# EasyEDA schematic SCH_东方红半导体演奏器_2022-09-28.json

## Sheets
1 乘法器: TITLE: M3495-BIS; REV: 1.0; Date: 2021-10-16; Sheet: 1/1; Drawn By: BH2VGM; Company: NEU-ISE
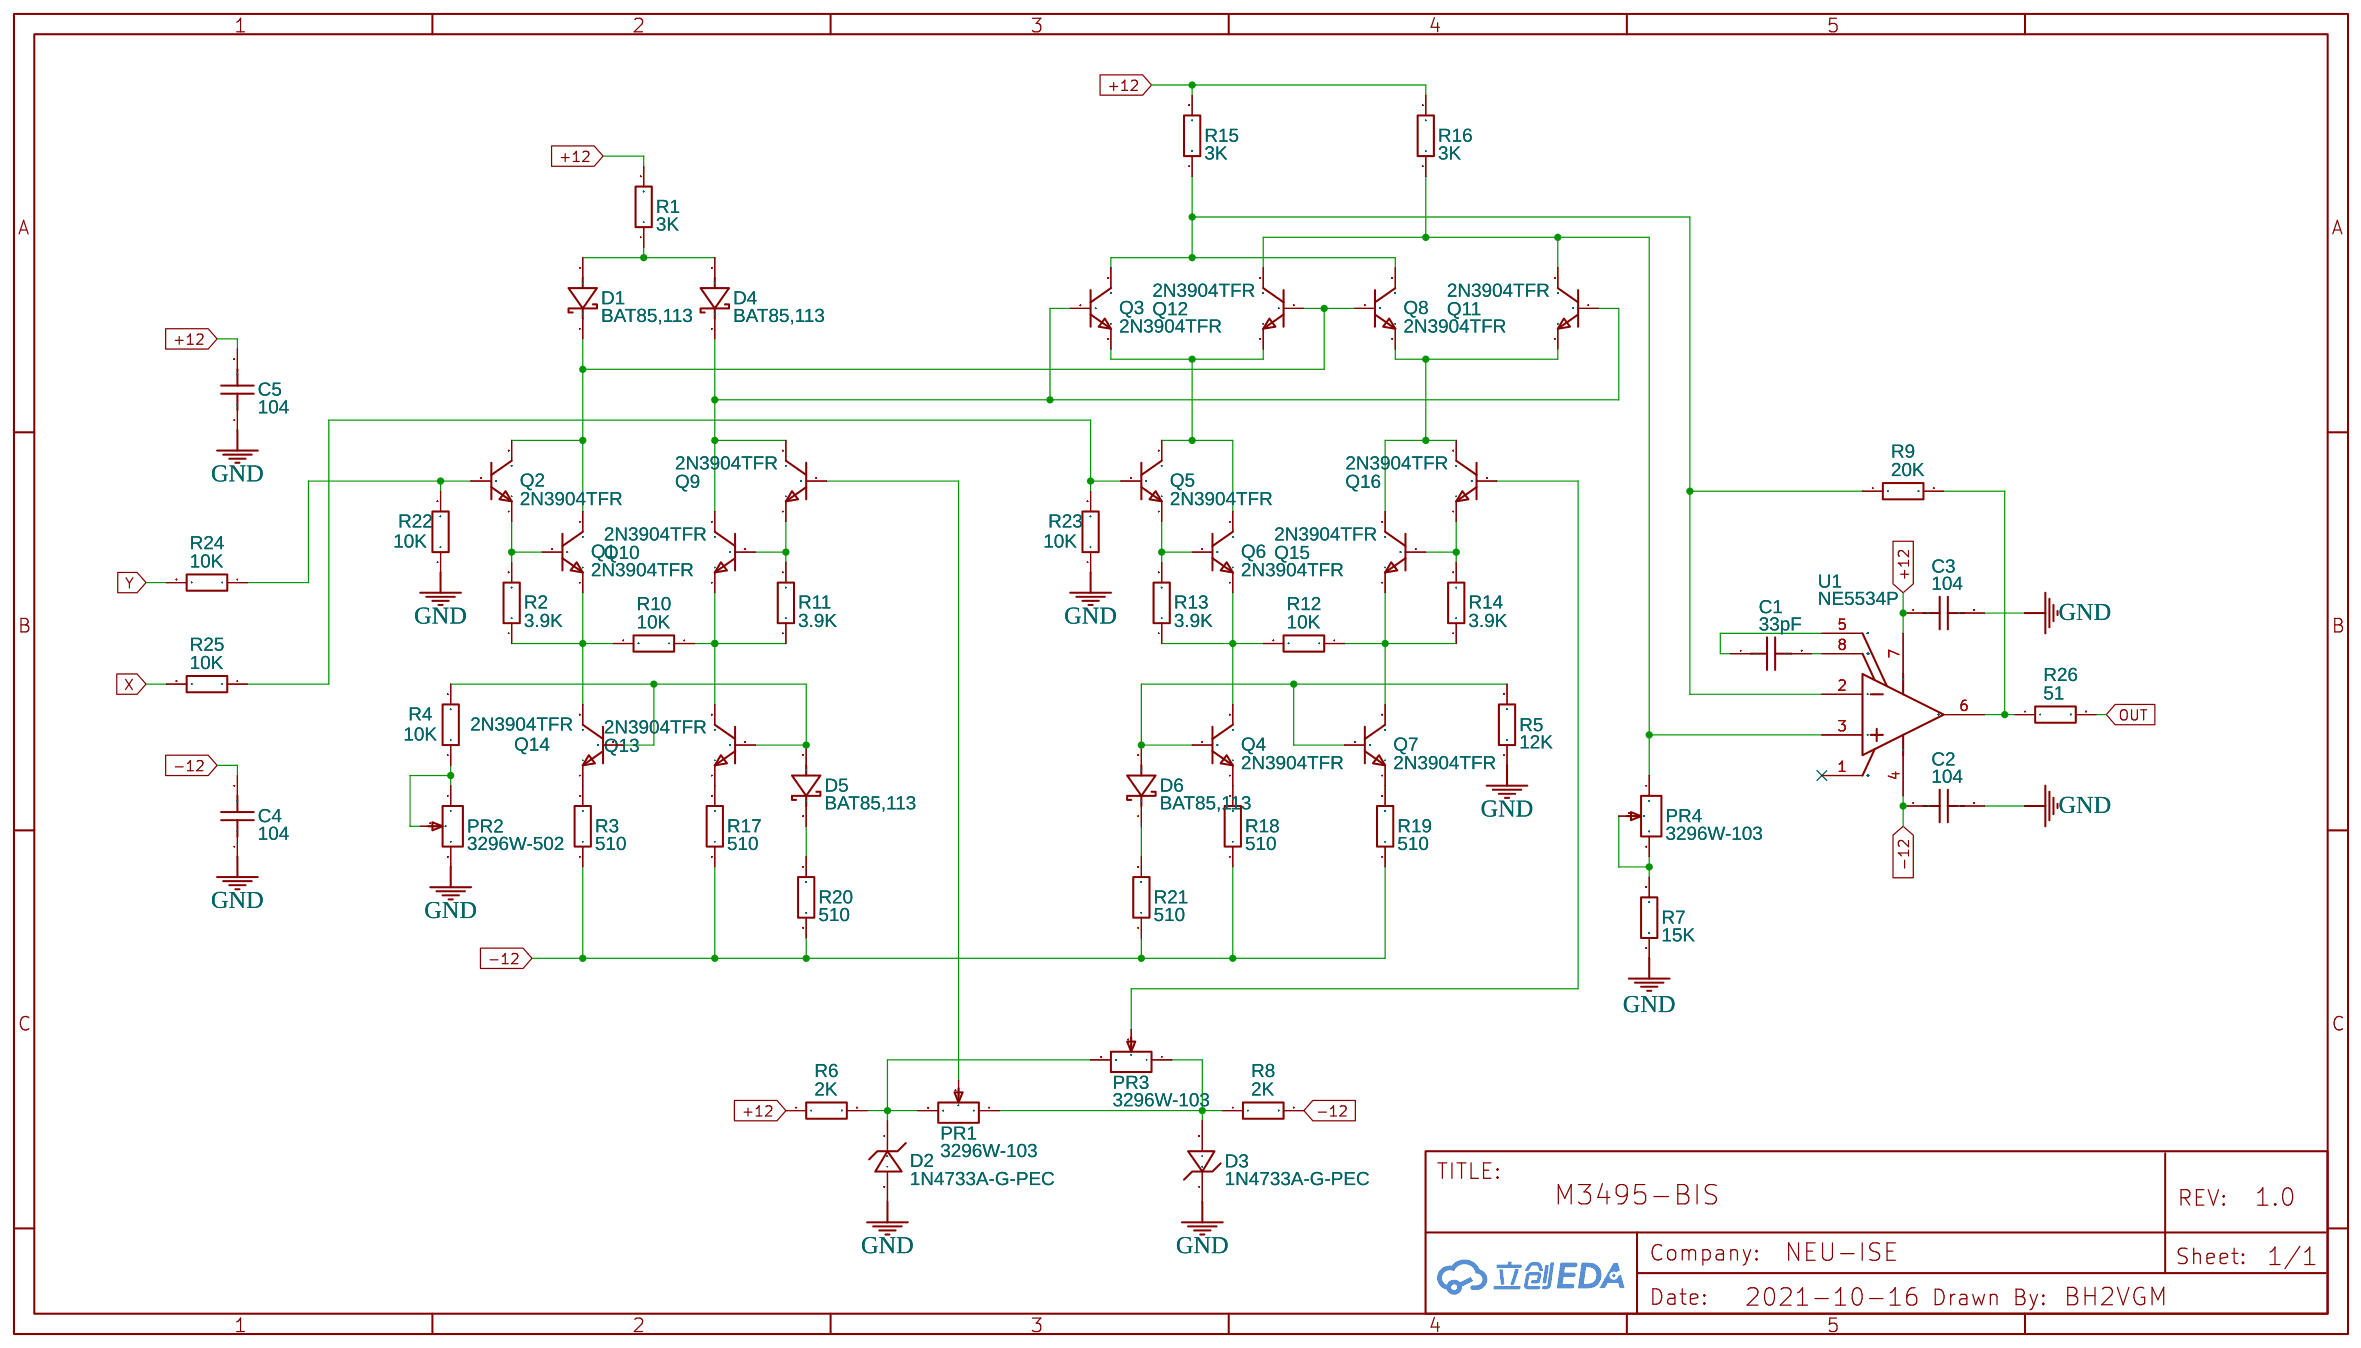
[diagram p0: 乘法器]
2 衰减信号发生器: TITLE: 衰减信号发生器; Company: NEU - ISE
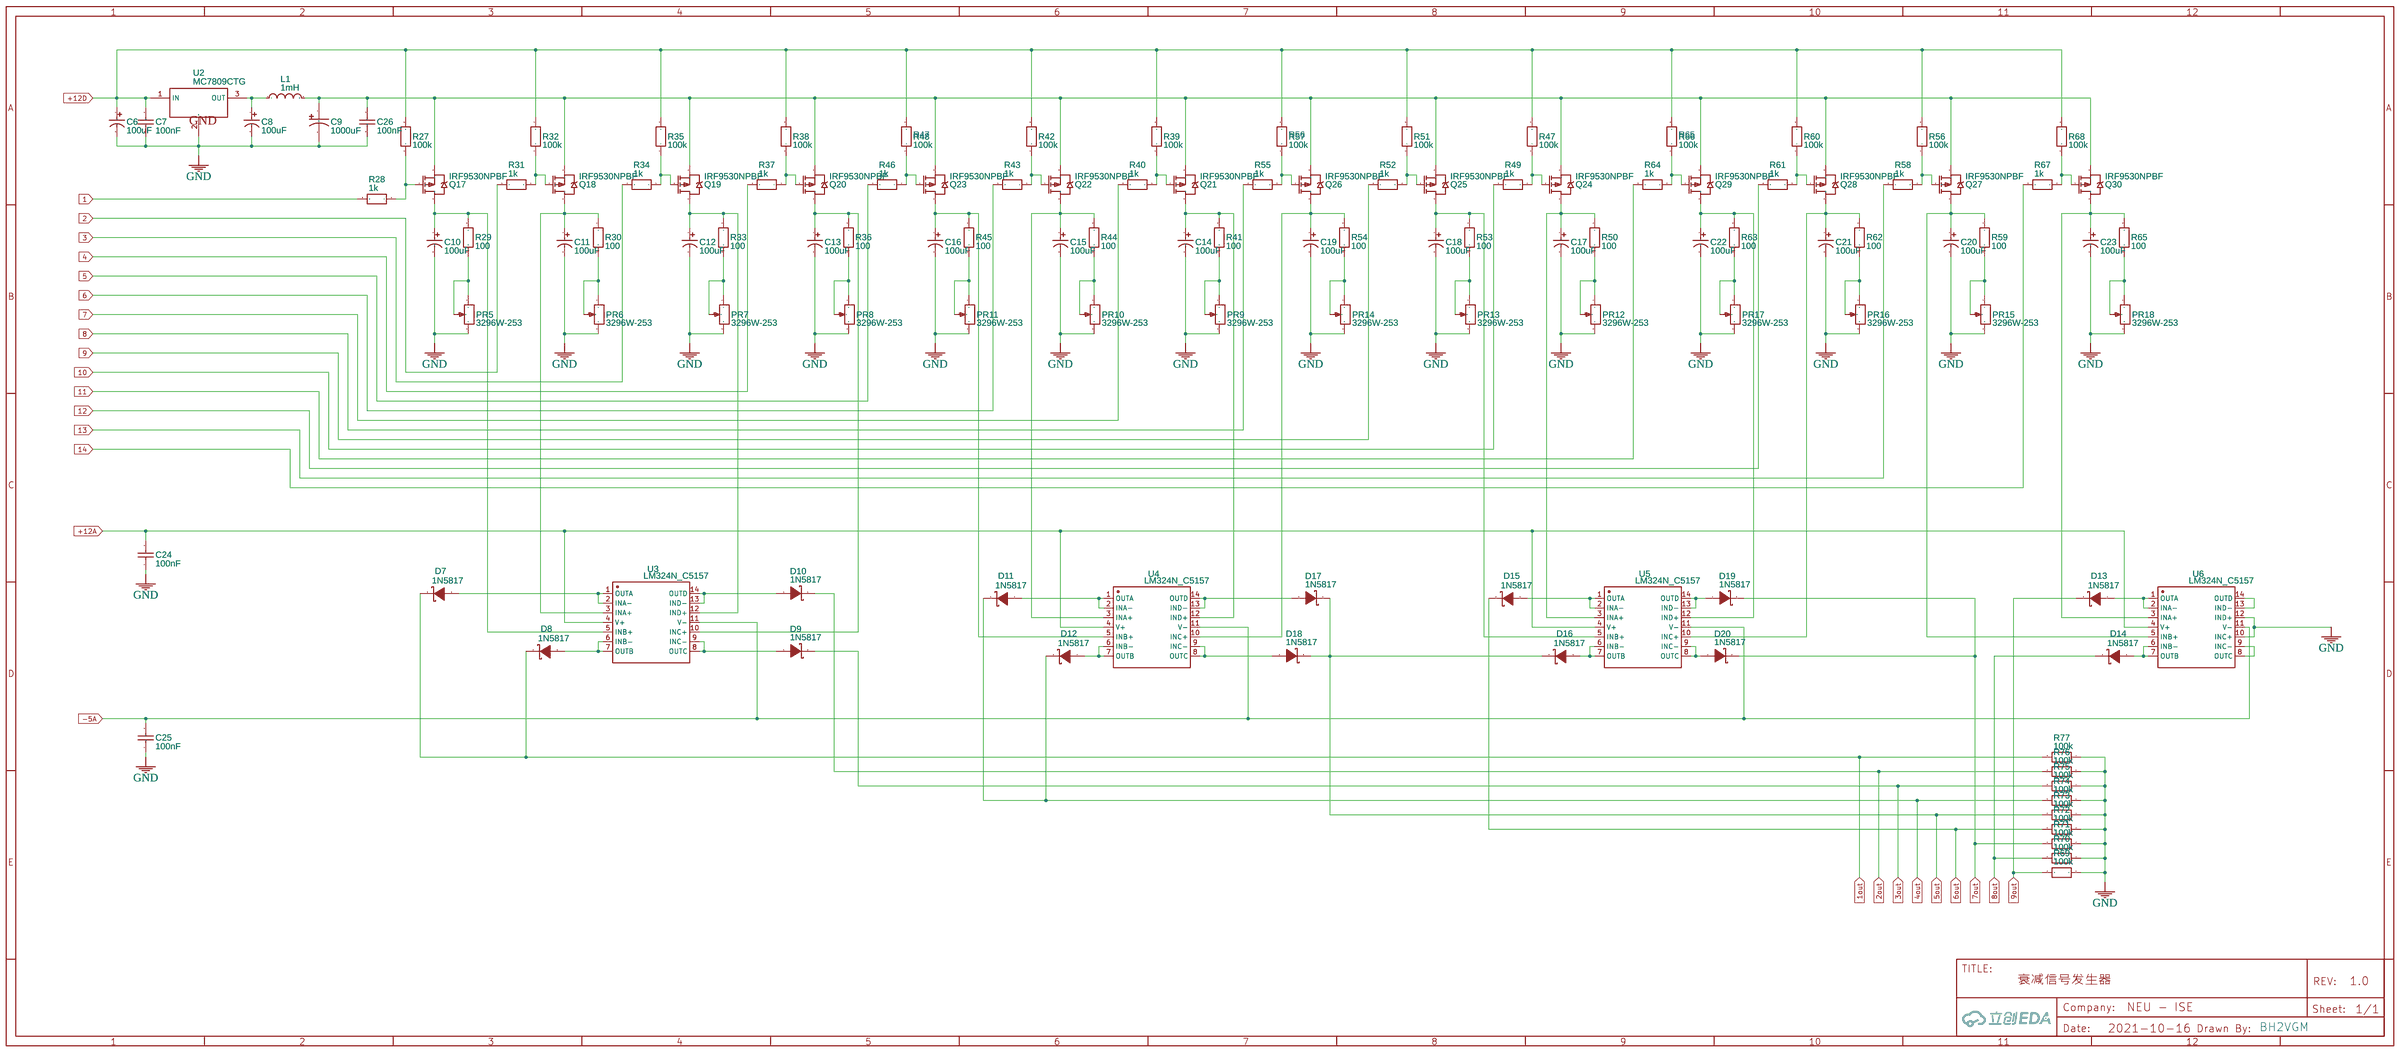
[diagram p1: 衰减信号发生器]
3 合成器: TITLE: 合成器; Date: 2021-10-24; Company: NEU - ISE
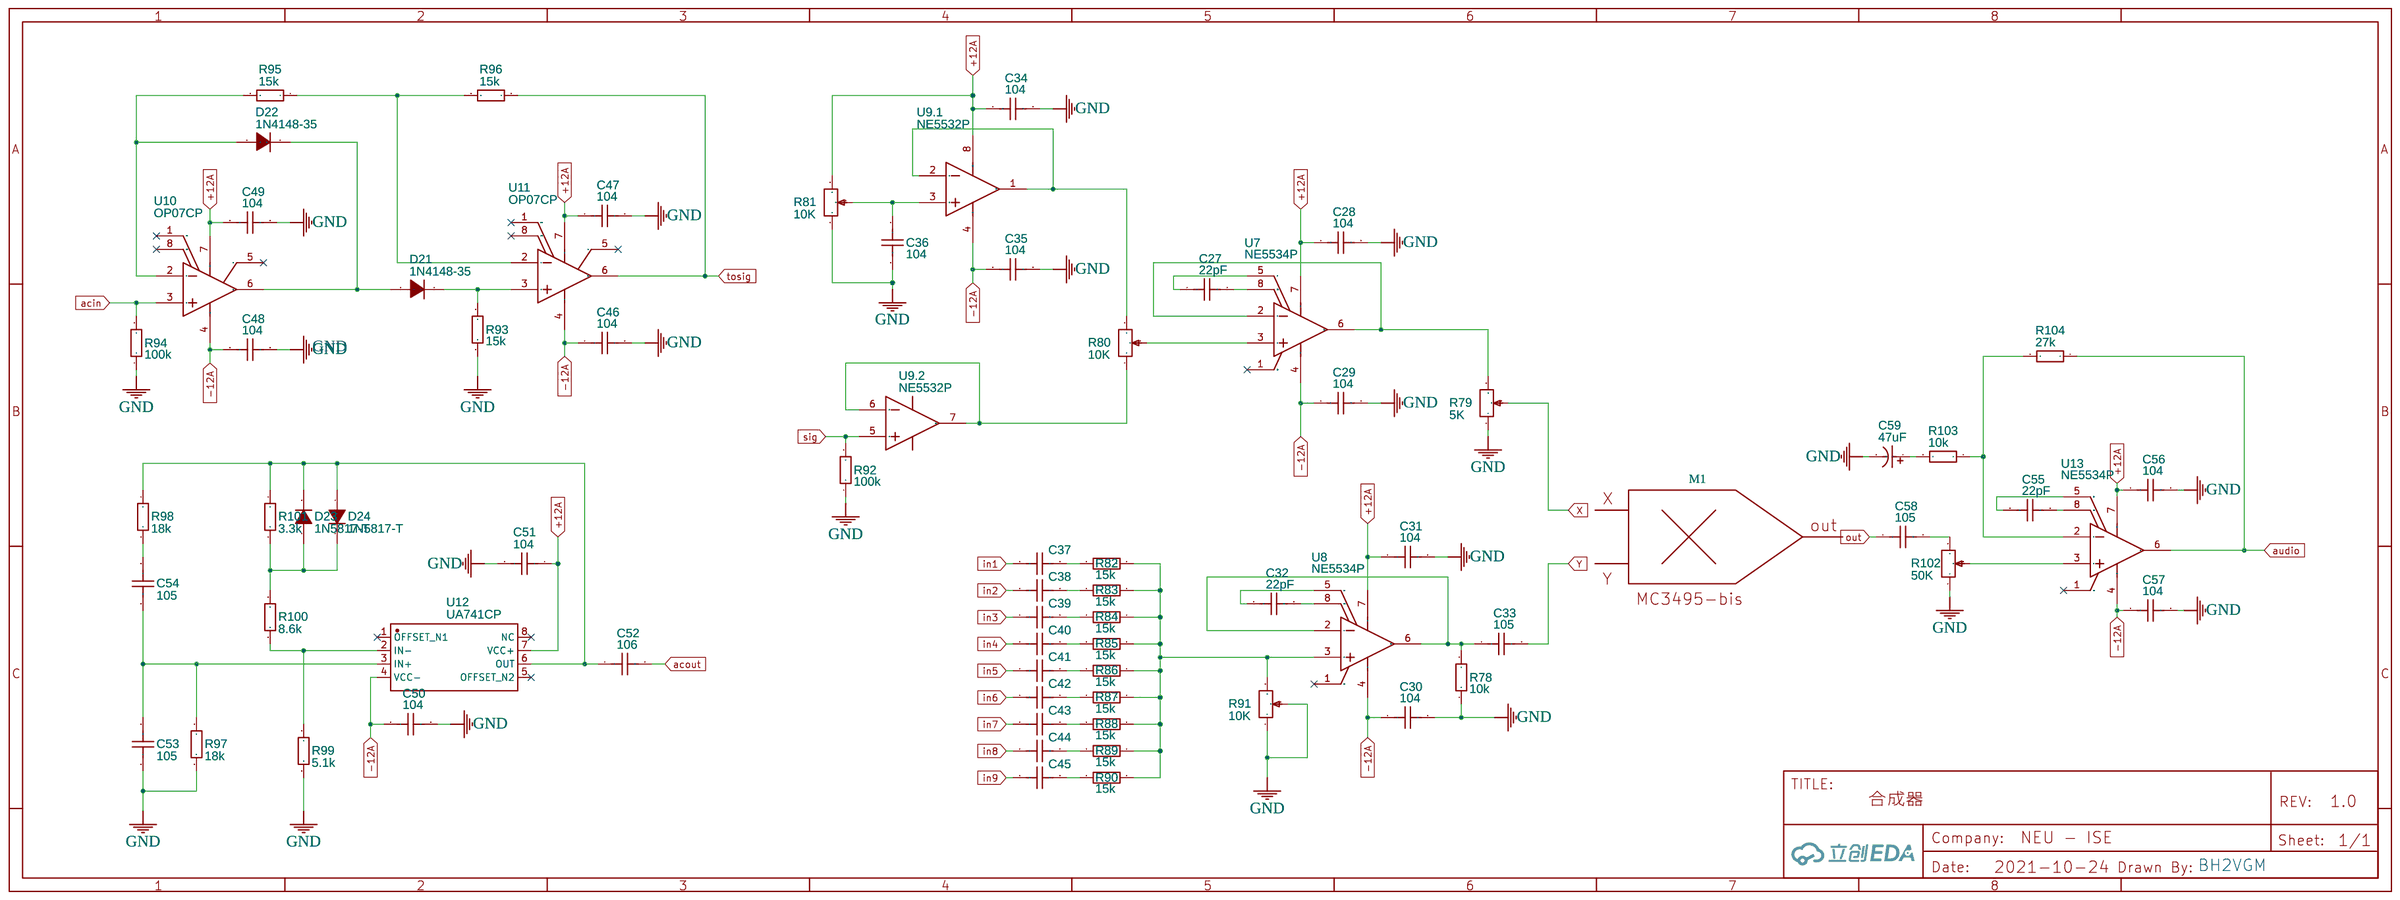
[diagram p2: 合成器]
4 音阶发生器: TITLE: Signals Generator; Company: NEU - ISE
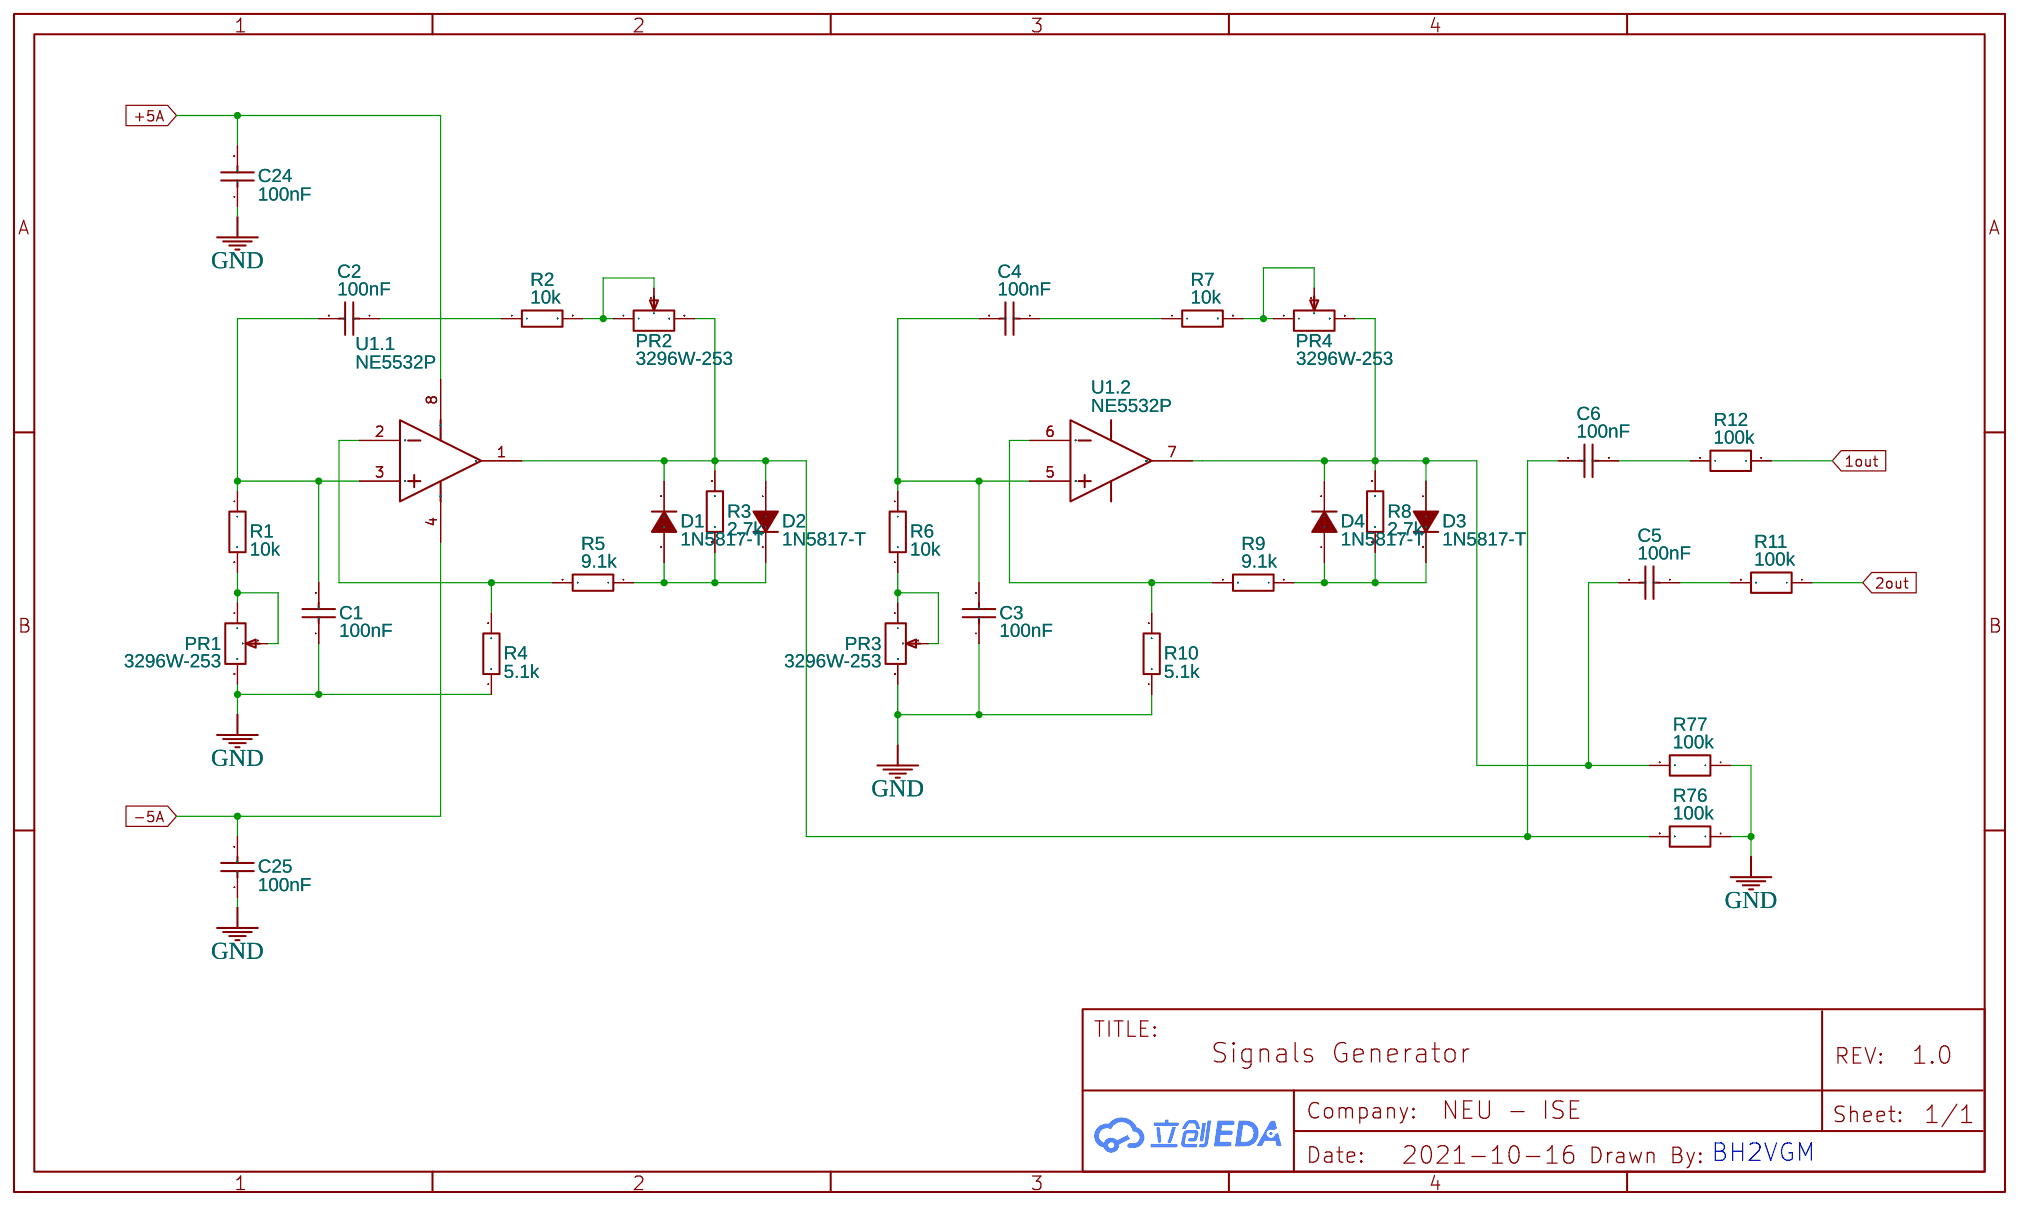
[diagram p3: 音阶发生器]

## Parts
sheet 乘法器
C1  33pF  [CAP-TH_L4.8-W3.2-P5.08-D1.2]
C2  104  [CAP-TH_L4.8-W3.2-P5.08-D1.2]
C3  104  [CAP-TH_L4.8-W3.2-P5.08-D1.2]
C4  104  [CAP-TH_L4.8-W3.2-P5.08-D1.2]
C5  104  [CAP-TH_L4.8-W3.2-P5.08-D1.2]
D1  BAT85,113  [DO-34_BD1.6-L3.0-P7.00-D0.6-RD]
D2  1N4733A-G-PEC  [DO-41G_BD2.4-L4.0-P8.00-D0.7-RD]
D3  1N4733A-G-PEC  [DO-41G_BD2.4-L4.0-P8.00-D0.7-RD]
D4  BAT85,113  [DO-34_BD1.6-L3.0-P7.00-D0.6-RD]
D5  BAT85,113  [DO-34_BD1.6-L3.0-P7.00-D0.6-RD]
D6  BAT85,113  [DO-34_BD1.6-L3.0-P7.00-D0.6-RD]
PR1  3296W-103  [RES-ADJ-TH_3296W]
PR2  3296W-502  [RES-ADJ-TH_3296W]
PR3  3296W-103  [RES-ADJ-TH_3296W]
PR4  3296W-103  [RES-ADJ-TH_3296W]
Q1  2N3904TFR  [TO-92-3_L4.8-W3.7-P2.54-L]
Q2  2N3904TFR  [TO-92-3_L4.8-W3.7-P2.54-L]
Q3  2N3904TFR  [TO-92-3_L4.8-W3.7-P2.54-L]
Q4  2N3904TFR  [TO-92-3_L4.8-W3.7-P2.54-L]
Q5  2N3904TFR  [TO-92-3_L4.8-W3.7-P2.54-L]
Q6  2N3904TFR  [TO-92-3_L4.8-W3.7-P2.54-L]
Q7  2N3904TFR  [TO-92-3_L4.8-W3.7-P2.54-L]
Q8  2N3904TFR  [TO-92-3_L4.8-W3.7-P2.54-L]
Q9  2N3904TFR  [TO-92-3_L4.8-W3.7-P2.54-L]
Q10  2N3904TFR  [TO-92-3_L4.8-W3.7-P2.54-L]
Q11  2N3904TFR  [TO-92-3_L4.8-W3.7-P2.54-L]
Q12  2N3904TFR  [TO-92-3_L4.8-W3.7-P2.54-L]
Q13  2N3904TFR  [TO-92-3_L4.8-W3.7-P2.54-L]
Q14  2N3904TFR  [TO-92-3_L4.8-W3.7-P2.54-L]
Q15  2N3904TFR  [TO-92-3_L4.8-W3.7-P2.54-L]
Q16  2N3904TFR  [TO-92-3_L4.8-W3.7-P2.54-L]
R1  3K  [RES-TH_BD2.3-L6.5-P10.50-D0.5]
R2  3.9K  [RES-TH_BD2.3-L6.5-P10.50-D0.5]
R3  510  [RES-TH_BD2.4-L6.3-P10.30-D0.6]
R4  10K  [RES-TH_BD2.3-L6.5-P10.50-D0.5]
R5  12K  [RES-TH_BD2.2-L6.5-P10.50-D0.6]
R6  2K  [RES-TH_BD2.3-L6.5-P10.50-D0.5]
R7  15K  [RES-TH_BD2.3-L6.5-P10.50-D0.5]
R8  2K  [RES-TH_BD2.3-L6.5-P10.50-D0.5]
R9  20K  [RES-TH_BD2.3-L6.5-P10.50-D0.5]
R10  10K  [RES-TH_BD2.3-L6.5-P10.50-D0.5]
R11  3.9K  [RES-TH_BD2.3-L6.5-P10.50-D0.5]
R12  10K  [RES-TH_BD2.3-L6.5-P10.50-D0.5]
R13  3.9K  [RES-TH_BD2.3-L6.5-P10.50-D0.5]
R14  3.9K  [RES-TH_BD2.3-L6.5-P10.50-D0.5]
R15  3K  [RES-TH_BD2.3-L6.5-P10.50-D0.5]
R16  3K  [RES-TH_BD2.3-L6.5-P10.50-D0.5]
R17  510  [RES-TH_BD2.4-L6.3-P10.30-D0.6]
R18  510  [RES-TH_BD2.4-L6.3-P10.30-D0.6]
R19  510  [RES-TH_BD2.4-L6.3-P10.30-D0.6]
R20  510  [RES-TH_BD2.4-L6.3-P10.30-D0.6]
R21  510  [RES-TH_BD2.4-L6.3-P10.30-D0.6]
R22  10K  [RES-TH_BD2.3-L6.5-P10.50-D0.5]
R23  10K  [RES-TH_BD2.3-L6.5-P10.50-D0.5]
R24  10K  [RES-TH_BD2.3-L6.5-P10.50-D0.5]
R25  10K  [RES-TH_BD2.3-L6.5-P10.50-D0.5]
R26  51  [RES-TH_BD2.3-L6.5-P10.50-D0.5]
U1  NE5534P  [DIP-8_L10.1-W6.3-P2.54-LS7.6-BL]
sheet 合成器
C27  22pF  [CAP-TH_L4.8-W3.2-P5.08-D0.5]
C28  104  [CAP-TH_L4.8-W3.2-P5.08-D0.5]
C29  104  [CAP-TH_L4.8-W3.2-P5.08-D0.5]
C30  104  [CAP-TH_L4.8-W3.2-P5.08-D0.5]
C31  104  [CAP-TH_L4.8-W3.2-P5.08-D0.5]
C32  22pF  [CAP-TH_L4.8-W3.2-P5.08-D0.5]
C33  105  [CAP-TH_L4.8-W3.2-P5.08-D0.5]
C34  104  [CAP-TH_L4.8-W3.2-P5.08-D0.5]
C35  104  [CAP-TH_L4.8-W3.2-P5.08-D0.5]
C36  104  [CAP-TH_L4.8-W3.2-P5.08-D0.5]
C37  104  [CAP-TH_L4.8-W3.2-P5.08-D0.5]
C38  104  [CAP-TH_L4.8-W3.2-P5.08-D0.5]
C39  104  [CAP-TH_L4.8-W3.2-P5.08-D0.5]
C40  104  [CAP-TH_L4.8-W3.2-P5.08-D0.5]
C41  104  [CAP-TH_L4.8-W3.2-P5.08-D0.5]
C42  104  [CAP-TH_L4.8-W3.2-P5.08-D0.5]
C43  104  [CAP-TH_L4.8-W3.2-P5.08-D0.5]
C44  104  [CAP-TH_L4.8-W3.2-P5.08-D0.5]
C45  104  [CAP-TH_L4.8-W3.2-P5.08-D0.5]
C46  104  [CAP-TH_L4.8-W3.2-P5.08-D0.5]
C47  104  [CAP-TH_L4.8-W3.2-P5.08-D0.5]
C48  104  [CAP-TH_L4.8-W3.2-P5.08-D0.5]
C49  104  [CAP-TH_L4.8-W3.2-P5.08-D0.5]
C50  104  [CAP-TH_L4.8-W3.2-P5.08-D0.5]
C51  104  [CAP-TH_L4.8-W3.2-P5.08-D0.5]
C52  106  [CAP-TH_L4.8-W3.2-P5.08-D0.5]
C53  105  [CAP-TH_L4.8-W3.2-P5.08-D0.5]
C54  105  [CAP-TH_L4.8-W3.2-P5.08-D0.5]
C55  22pF  [CAP-TH_L4.8-W3.2-P5.08-D0.5]
C56  104  [CAP-TH_L4.8-W3.2-P5.08-D0.5]
C57  104  [CAP-TH_L4.8-W3.2-P5.08-D0.5]
C58  105  [CAP-TH_L4.8-W3.2-P5.08-D0.5]
C59  47uF  [CAP-TH_BD5.0-P2.00-D0.8-FD]
D21  1N4148-35  [DO-35_BD2.0-L4.2-P8.20-D0.5-RD]
D22  1N4148-35  [DO-35_BD2.0-L4.2-P8.20-D0.5-RD]
D23  1N5817-T  [DO-41_BD2.4-L4.7-P8.70-D0.9-FD]
D24  1N5817-T  [DO-41_BD2.4-L4.7-P8.70-D0.9-FD]
M1  none
R78  10k  [RES-TH_BD2.3-L6.5-P10.50-D0.5]
R79  5K  [RES-ADJ-TH_3296W]
R80  10K  [RES-ADJ-TH_3296W]
R81  10K  [RES-ADJ-TH_3296W]
R82  15k  [RES-TH_BD2.3-L6.5-P10.50-D0.5]
R83  15k  [RES-TH_BD2.3-L6.5-P10.50-D0.5]
R84  15k  [RES-TH_BD2.3-L6.5-P10.50-D0.5]
R85  15k  [RES-TH_BD2.3-L6.5-P10.50-D0.5]
R86  15k  [RES-TH_BD2.3-L6.5-P10.50-D0.5]
R87  15k  [RES-TH_BD2.3-L6.5-P10.50-D0.5]
R88  15k  [RES-TH_BD2.3-L6.5-P10.50-D0.5]
R89  15k  [RES-TH_BD2.3-L6.5-P10.50-D0.5]
R90  15k  [RES-TH_BD2.3-L6.5-P10.50-D0.5]
R91  10K  [RES-ADJ-TH_3296W]
R92  100k  [RES-TH_BD2.3-L6.5-P10.50-D0.5]
R93  15k  [RES-TH_BD2.3-L6.5-P10.50-D0.5]
R94  100k  [RES-TH_BD2.3-L6.5-P10.50-D0.5]
R95  15k  [RES-TH_BD2.3-L6.5-P10.50-D0.5]
R96  15k  [RES-TH_BD2.3-L6.5-P10.50-D0.5]
R97  18k  [RES-TH_BD2.3-L6.5-P10.50-D0.5]
R98  18k  [RES-TH_BD2.3-L6.5-P10.50-D0.5]
R99  5.1k  [RES-TH_BD2.3-L6.5-P10.50-D0.5]
R100  8.6k  [RES-TH_BD2.3-L6.5-P10.50-D0.5]
R101  3.3k  [RES-TH_BD2.3-L6.5-P10.50-D0.5]
R102  50K  [RES-ADJ-TH_3296W]
R103  10k  [RES-TH_BD2.3-L6.5-P10.50-D0.5]
R104  27k  [RES-TH_BD2.3-L6.5-P10.50-D0.5]
U7  NE5534P  [DIP-8_L10.1-W6.3-P2.54-LS7.6-BL]
U8  NE5534P  [DIP-8_L10.1-W6.3-P2.54-LS7.6-BL]
U9  NE5532P  [DIP-8_L9.4-W6.4-P2.54-LS9.1-BL]  (sections 1,2)
U10  OP07CP  [DIP-8_L9.4-W6.4-P2.54-LS9.1-BL]
U11  OP07CP  [DIP-8_L9.4-W6.4-P2.54-LS9.1-BL]
U12  UA741CP  [DIP-8_L9.6-W6.4-P2.54-LS7.6-BL-1]
U13  NE5534P  [DIP-8_L10.1-W6.3-P2.54-LS7.6-BL]
sheet 衰减信号发生器
C6  100uF  [CAP-TH_BD8.0-P3.50-D0.6-FD]
C7  100nF  [CAP-TH_L5.3-W3.8-P5.08-D0.5]
C8  100uF  [CAP-TH_BD8.0-P3.50-D0.6-FD]
C9  1000uF  [CAP-TH_BD12.5-P5.00-D0.6-FD]
C10  100uF  [CAP-TH_BD8.0-P3.50-D0.6-FD]
C11  100uF  [CAP-TH_BD8.0-P3.50-D0.6-FD]
C12  100uF  [CAP-TH_BD8.0-P3.50-D0.6-FD]
C13  100uF  [CAP-TH_BD8.0-P3.50-D0.6-FD]
C14  100uF  [CAP-TH_BD8.0-P3.50-D0.6-FD]
C15  100uF  [CAP-TH_BD8.0-P3.50-D0.6-FD]
C16  100uF  [CAP-TH_BD8.0-P3.50-D0.6-FD]
C17  100uF  [CAP-TH_BD8.0-P3.50-D0.6-FD]
C18  100uF  [CAP-TH_BD8.0-P3.50-D0.6-FD]
C19  100uF  [CAP-TH_BD8.0-P3.50-D0.6-FD]
C20  100uF  [CAP-TH_BD8.0-P3.50-D0.6-FD]
C21  100uF  [CAP-TH_BD8.0-P3.50-D0.6-FD]
C22  100uF  [CAP-TH_BD8.0-P3.50-D0.6-FD]
C23  100uF  [CAP-TH_BD8.0-P3.50-D0.6-FD]
C24  100nF  [CAP-TH_L5.3-W3.8-P5.08-D0.5]
C25  100nF  [CAP-TH_L5.3-W3.8-P5.08-D0.5]
C26  100nF  [CAP-TH_L5.3-W3.8-P5.08-D0.5]
D7  1N5817  [DO-41_BD2.4-L4.7-P8.70-D0.9-FD]
D8  1N5817  [DO-41_BD2.4-L4.7-P8.70-D0.9-FD]
D9  1N5817  [DO-41_BD2.4-L4.7-P8.70-D0.9-FD]
D10  1N5817  [DO-41_BD2.4-L4.7-P8.70-D0.9-FD]
D11  1N5817  [DO-41_BD2.4-L4.7-P8.70-D0.9-FD]
D12  1N5817  [DO-41_BD2.4-L4.7-P8.70-D0.9-FD]
D13  1N5817  [DO-41_BD2.4-L4.7-P8.70-D0.9-FD]
D14  1N5817  [DO-41_BD2.4-L4.7-P8.70-D0.9-FD]
D15  1N5817  [DO-41_BD2.4-L4.7-P8.70-D0.9-FD]
D16  1N5817  [DO-41_BD2.4-L4.7-P8.70-D0.9-FD]
D17  1N5817  [DO-41_BD2.4-L4.7-P8.70-D0.9-FD]
D18  1N5817  [DO-41_BD2.4-L4.7-P8.70-D0.9-FD]
D19  1N5817  [DO-41_BD2.4-L4.7-P8.70-D0.9-FD]
D20  1N5817  [DO-41_BD2.4-L4.7-P8.70-D0.9-FD]
L1  1mH  [IND-TH_BD9.5-P5.00-D0.7]
PR5  3296W-253  [RES-ADJ-TH_3296W]
PR6  3296W-253  [RES-ADJ-TH_3296W]
PR7  3296W-253  [RES-ADJ-TH_3296W]
PR8  3296W-253  [RES-ADJ-TH_3296W]
PR9  3296W-253  [RES-ADJ-TH_3296W]
PR10  3296W-253  [RES-ADJ-TH_3296W]
PR11  3296W-253  [RES-ADJ-TH_3296W]
PR12  3296W-253  [RES-ADJ-TH_3296W]
PR13  3296W-253  [RES-ADJ-TH_3296W]
PR14  3296W-253  [RES-ADJ-TH_3296W]
PR15  3296W-253  [RES-ADJ-TH_3296W]
PR16  3296W-253  [RES-ADJ-TH_3296W]
PR17  3296W-253  [RES-ADJ-TH_3296W]
PR18  3296W-253  [RES-ADJ-TH_3296W]
Q17  IRF9530NPBF  [TO-220-3_L10.0-W4.5-P2.54-L]
Q18  IRF9530NPBF  [TO-220-3_L10.0-W4.5-P2.54-L]
Q19  IRF9530NPBF  [TO-220-3_L10.0-W4.5-P2.54-L]
Q20  IRF9530NPBF  [TO-220-3_L10.0-W4.5-P2.54-L]
Q21  IRF9530NPBF  [TO-220-3_L10.0-W4.5-P2.54-L]
Q22  IRF9530NPBF  [TO-220-3_L10.0-W4.5-P2.54-L]
Q23  IRF9530NPBF  [TO-220-3_L10.0-W4.5-P2.54-L]
Q24  IRF9530NPBF  [TO-220-3_L10.0-W4.5-P2.54-L]
Q25  IRF9530NPBF  [TO-220-3_L10.0-W4.5-P2.54-L]
Q26  IRF9530NPBF  [TO-220-3_L10.0-W4.5-P2.54-L]
Q27  IRF9530NPBF  [TO-220-3_L10.0-W4.5-P2.54-L]
Q28  IRF9530NPBF  [TO-220-3_L10.0-W4.5-P2.54-L]
Q29  IRF9530NPBF  [TO-220-3_L10.0-W4.5-P2.54-L]
Q30  IRF9530NPBF  [TO-220-3_L10.0-W4.5-P2.54-L]
R27  100k  [RES-TH_BD2.4-L6.3-P10.30-D0.6]
R28  1k  [RES-TH_BD2.4-L6.3-P10.30-D0.6]
R29  100  [RES-TH_BD2.4-L6.3-P10.30-D0.6]
R30  100  [RES-TH_BD2.4-L6.3-P10.30-D0.6]
R31  1k  [RES-TH_BD2.4-L6.3-P10.30-D0.6]
R32  100k  [RES-TH_BD2.4-L6.3-P10.30-D0.6]
R33  100  [RES-TH_BD2.4-L6.3-P10.30-D0.6]
R34  1k  [RES-TH_BD2.4-L6.3-P10.30-D0.6]
R35  100k  [RES-TH_BD2.4-L6.3-P10.30-D0.6]
R36  100  [RES-TH_BD2.4-L6.3-P10.30-D0.6]
R37  1k  [RES-TH_BD2.4-L6.3-P10.30-D0.6]
R38  100k  [RES-TH_BD2.4-L6.3-P10.30-D0.6]
R39  100k  [RES-TH_BD2.4-L6.3-P10.30-D0.6]
R40  1k  [RES-TH_BD2.4-L6.3-P10.30-D0.6]
R41  100  [RES-TH_BD2.4-L6.3-P10.30-D0.6]
R42  100k  [RES-TH_BD2.4-L6.3-P10.30-D0.6]
R43  1k  [RES-TH_BD2.4-L6.3-P10.30-D0.6]
R44  100  [RES-TH_BD2.4-L6.3-P10.30-D0.6]
R45  100  [RES-TH_BD2.4-L6.3-P10.30-D0.6]
R46  1k  [RES-TH_BD2.4-L6.3-P10.30-D0.6]
R47  100k  [RES-TH_BD2.4-L6.3-P10.30-D0.6]
R48  100k  [RES-TH_BD2.4-L6.3-P10.30-D0.6]
R49  1k  [RES-TH_BD2.4-L6.3-P10.30-D0.6]
R50  100  [RES-TH_BD2.4-L6.3-P10.30-D0.6]
R51  100k  [RES-TH_BD2.4-L6.3-P10.30-D0.6]
R52  1k  [RES-TH_BD2.4-L6.3-P10.30-D0.6]
R53  100  [RES-TH_BD2.4-L6.3-P10.30-D0.6]
R54  100  [RES-TH_BD2.4-L6.3-P10.30-D0.6]
R55  1k  [RES-TH_BD2.4-L6.3-P10.30-D0.6]
R56  100k  [RES-TH_BD2.4-L6.3-P10.30-D0.6]
R57  100k  [RES-TH_BD2.4-L6.3-P10.30-D0.6]
R58  1k  [RES-TH_BD2.4-L6.3-P10.30-D0.6]
R59  100  [RES-TH_BD2.4-L6.3-P10.30-D0.6]
R60  100k  [RES-TH_BD2.4-L6.3-P10.30-D0.6]
R61  1k  [RES-TH_BD2.4-L6.3-P10.30-D0.6]
R62  100  [RES-TH_BD2.4-L6.3-P10.30-D0.6]
R63  100  [RES-TH_BD2.4-L6.3-P10.30-D0.6]
R64  1k  [RES-TH_BD2.4-L6.3-P10.30-D0.6]
R65  100  [RES-TH_BD2.4-L6.3-P10.30-D0.6]
R66  100k  [RES-TH_BD2.4-L6.3-P10.30-D0.6]
R67  1k  [RES-TH_BD2.4-L6.3-P10.30-D0.6]
R68  100k  [RES-TH_BD2.4-L6.3-P10.30-D0.6]
R69  100k  [RES-TH_BD2.4-L6.3-P10.30-D0.6]
R70  100k  [RES-TH_BD2.4-L6.3-P10.30-D0.6]
R71  100k  [RES-TH_BD2.4-L6.3-P10.30-D0.6]
R72  100k  [RES-TH_BD2.4-L6.3-P10.30-D0.6]
R73  100k  [RES-TH_BD2.4-L6.3-P10.30-D0.6]
R74  100k  [RES-TH_BD2.4-L6.3-P10.30-D0.6]
R75  100k  [RES-TH_BD2.4-L6.3-P10.30-D0.6]
R76  100k  [RES-TH_BD2.4-L6.3-P10.30-D0.6]
R77  100k  [RES-TH_BD2.4-L6.3-P10.30-D0.6]
U2  MC7809CTG  [TO-220-3_L10.0-W4.5-P2.54-L]
U3  LM324N_C5157  [PDIP-14_L19.7-W6.6-P2.54-LS8.3-BL]
U4  LM324N_C5157  [PDIP-14_L19.7-W6.6-P2.54-LS8.3-BL]
U5  LM324N_C5157  [PDIP-14_L19.7-W6.6-P2.54-LS8.3-BL]
U6  LM324N_C5157  [PDIP-14_L19.7-W6.6-P2.54-LS8.3-BL]
sheet 音阶发生器
C1#2  100nF  [RAD-0.2]
C2#2  100nF  [RAD-0.2]
C3#2  100nF  [RAD-0.2]
C4#2  100nF  [RAD-0.2]
C5#2  100nF  [RAD-0.2]
C6#2  100nF  [RAD-0.2]
C24#2  100nF  [CAP-TH_L5.3-W3.8-P5.08-D0.5]
C25#2  100nF  [CAP-TH_L5.3-W3.8-P5.08-D0.5]
D1#2  1N5817-T  [DO-41_BD2.4-L4.7-P8.70-D0.9-FD]
D2#2  1N5817-T  [DO-41_BD2.4-L4.7-P8.70-D0.9-FD]
D3#2  1N5817-T  [DO-41_BD2.4-L4.7-P8.70-D0.9-FD]
D4#2  1N5817-T  [DO-41_BD2.4-L4.7-P8.70-D0.9-FD]
PR1#2  3296W-253  [RES-ADJ-TH_3296W]
PR2#2  3296W-253  [RES-ADJ-TH_3296W]
PR3#2  3296W-253  [RES-ADJ-TH_3296W]
PR4#2  3296W-253  [RES-ADJ-TH_3296W]
R1#2  10k  [RES-TH_BD2.2-L6.5-P10.50-D0.6]
R2#2  10k  [RES-TH_BD2.2-L6.5-P10.50-D0.6]
R3#2  2.7k  [RES-TH_BD2.2-L6.5-P10.50-D0.6]
R4#2  5.1k  [RES-TH_BD2.2-L6.5-P10.50-D0.6]
R5#2  9.1k  [RES-TH_BD2.2-L6.5-P10.50-D0.6]
R6#2  10k  [RES-TH_BD2.2-L6.5-P10.50-D0.6]
R7#2  10k  [RES-TH_BD2.2-L6.5-P10.50-D0.6]
R8#2  2.7k  [RES-TH_BD2.2-L6.5-P10.50-D0.6]
R9#2  9.1k  [RES-TH_BD2.2-L6.5-P10.50-D0.6]
R10#2  5.1k  [RES-TH_BD2.2-L6.5-P10.50-D0.6]
R11#2  100k  [RES-TH_BD2.4-L6.3-P10.30-D0.6]
R12#2  100k  [RES-TH_BD2.4-L6.3-P10.30-D0.6]
R76#2  100k  [RES-TH_BD2.4-L6.3-P10.30-D0.6]
R77#2  100k  [RES-TH_BD2.4-L6.3-P10.30-D0.6]
U1.1  NE5532P  [DIP-8_L9.4-W6.4-P2.54-LS9.1-BL]
U1.2  NE5532P  [DIP-8_L9.4-W6.4-P2.54-LS9.1-BL]

## Library data of the parts
C1-C5 = CC4-0805N330 J500: Supplier: LCSC; Manufacturer: ReliaPro; Supplier Part: C3776
D1 D4-D6 = BAT85,113: Supplier: LCSC; Supplier Part: C549292; Manufacturer: Nexperia; Contributor: LCSC; JLCPCB Part Class: Extended Part
D2 D3 = 1N4733A-G-PEC: Supplier: LCSC; Supplier Part: C263131; Manufacturer: PANJIT International; Contributor: LCSC; JLCPCB Part Class: Extended Part
PR1 PR1#2 PR2 PR2#2 PR3 PR3#2 PR4 PR4#2 PR5-PR18 = 3296W-253: Supplier Part: C36040; Supplier: LCSC; Manufacturer: ReliaPro
Q1-Q16 = 2N3904TFR: Supplier: LCSC; Supplier Part: C258185; Manufacturer: ON Semicon; Contributor: LCSC; JLCPCB Part Class: Extended Part
R1 R6-R8 R15 R16 = CF1/4W-3KΩ±5% T52: Supplier: LCSC; Supplier Part: C120066; Manufacturer: Chian Chia Elec; Contributor: LCSC; JLCPCB Part Class: Extended Part
R2 R11 R13 R14 = MF1/2WS-3.9KΩ±1% T52: Supplier: LCSC; Supplier Part: C129909; Manufacturer: Chian Chia Elec; Contributor: LCSC; JLCPCB Part Class: Extended Part
R3 R17-R21 = MFR50SFTE52-510R: Supplier: LCSC; Supplier Part: C173157; Manufacturer: YAGEO; Contributor: LCSC; JLCPCB Part Class: Extended Part
R4 R9 R10 R12 R22-R26 = MF1/4W-10KΩ±1% T52: Supplier: LCSC; Supplier Part: C119347; Manufacturer: Chian Chia Elec; Contributor: LCSC; JLCPCB Part Class: Extended Part
R5 = CF1/4W-120KΩ±5% T52: Supplier: LCSC; Supplier Part: C120105; Manufacturer: Chian Chia Elec; Contributor: LCSC; JLCPCB Part Class: Extended Part
U1 U7 U8 U13 = NE5534P: Supplier: LCSC; Manufacturer: TI; Supplier Part: C9917; JLCPCB Part Class: Extended Part
C27-C58 = CC4-0805-CG -50V-22pF-J: Supplier: LCSC; Supplier Part: C123150; Manufacturer: TORCH; Contributor: LCSC; JLCPCB Part Class: Extended Part
C59 = 47uF 35V: Supplier: LCSC; Manufacturer: ValuePro; Supplier Part: C40063; JLCPCB Part Class: Extended Part
D21 D22 = 1N4148-35: Supplier: LCSC; Manufacturer: PANJIT; Contributor: LCSC; Supplier Part: C116001; JLCPCB Part Class: Extended Part
D1#2 D2#2 D3#2 D4#2 D23 D24 = 1N5817-T: Supplier: LCSC; Supplier Part: C507852; Manufacturer: Diodes Incorporated; Contributor: LCSC; JLCPCB Part Class: Extended Part
R78 R82-R90 R92-R101 R103 R104 = KNP1/4W-0.22Ω±5% T: Supplier: LCSC; Supplier Part: C122074; Manufacturer: Chian Chia Elec; Contributor: LCSC; JLCPCB Part Class: Extended Part
R79-R81 R91 R102 = 3296W-1-104LF: Supplier: LCSC; Manufacturer: BOURNS; Supplier Part: C48084; Resistance(Ohms): 100K; JLCPCB Part Class: Extended Part
U1.1 U1.2 U9 = NE5532P: tags: Audio Operational Amplifier; Supplier Part: C5326; Supplier: LCSC; Manufacturer: TI; subpart_no: 1; image: http://image.lceda.cn/szlcsc/C5326.jpg; JLCPCB Part Class: Extended Part
U10 U11 = OP07CP: Supplier: LCSC; Manufacturer: TI; Supplier Part: C5224; JLCPCB Part Class: Extended Part
U12 = UA741CP: Supplier: LCSC; Manufacturer: TI; Supplier Part: C78758; JLCPCB Part Class: Extended Part
C6 C8 C10-C23 = 100uF 35V 8*12: Supplier: LCSC; Manufacturer: ValuePro; Supplier Part: C45077
C7 C24 C24#2 C25 C25#2 C26 = Monolithic0805B104J500F3: Supplier: LCSC; Manufacturer: FH; Supplier Part: C110282; JLCPCB Part Class: Extended Part
C9 = UVR1H102MHD: Supplier: LCSC; Supplier Part: C125980; Manufacturer: Nichicon; Contributor: LCSC; JLCPCB Part Class: Extended Part
D7-D20 = 1N5817: Supplier: LCSC; Manufacturer: MDD; Supplier Part: C3062; JLCPCB Part Class: Extended Part
L1 = VLU0810-102K: Supplier: LCSC; Manufacturer: FH; Supplier Part: C72626; JLCPCB Part Class: Extended Part
Q17-Q30 = IRF9530NPBF: Supplier: LCSC; Manufacturer: IR; Supplier Part: C2574; JLCPCB Part Class: Extended Part
R11#2 R12#2 R27-R76 R76#2 R77 R77#2 = RN 1/4W 10R F T/B A1: Supplier: LCSC; Supplier Part: C410692; Manufacturer: TyoHM; Contributor: LCSC; JLCPCB Part Class: Extended Part
U2 = MC7809CTG: Supplier: LCSC; Manufacturer: ON; Supplier Part: C126395; JLCPCB Part Class: Extended Part
U3-U6 = LM324N_C5157: Supplier: LCSC; Supplier Part: C5157; Manufacturer: ST(意法半导体); Manufacturer Part: LM324N; Contributor: LCSC; JLCPCB Part Class: Extended Part
C1#2 C2#2 C3#2 C4#2 C5#2 C6#2 = 100nF: Supplier: LCSC; Manufacturer: LCSC; Manufacturer Part: 0.1UF(104) +-20% 63v; Supplier Part: C19355
R1#2 R2#2 R3#2 R4#2 R5#2 R6#2 R7#2 R8#2 R9#2 R10#2 = CF1/4W-10MΩ±5%: Supplier: LCSC; Manufacturer: CCO; Supplier Part: C127261; JLCPCB Part Class: Extended Part

## Nets
GND: C1#2.1 C2.2 C3.2 C3#2.1 C4.1 C5.1 C6.2 C7.1 C8.2 C9.2 C10.2 C11.2 C12.2 C13.2 C14.2 C15.2 C16.2 C17.2 C18.2 C19.2 C20.2 C21.2 C22.2 C23.2 C24.1 C24#2.1 C25.1 C25#2.1 C26.1 C28.2 C29.2 C30.2 C31.2 C34.2 C35.2 C36.2 C46.2 C47.2 C48.2 C49.2 C50.2 C51.2 C53.1 C56.2 C57.2 C59.2 D2.2(A) D3.1(C) PR1#2.3 PR2.3 PR3#2.3 PR5.3 PR6.3 PR7.3 PR8.3 PR9.3 PR10.3 PR11.3 PR12.3 PR13.3 PR14.3 PR15.3 PR16.3 PR17.3 PR18.3 R4#2.1 R5.1 R7.1 R10#2.1 R22.1 R23.1 R69.1 R70.1 R71.1 R72.1 R73.1 R74.1 R75.1 R76.1 R76#2.1 R77.1 R77#2.1 R78.1 R79.1 R81.1 R91.1 R91.2 R92.1 R93.1 R94.1 R97.2 R99.2 R102.1 U2.2(GND) U6.10(INC+) U6.12(IND+)
1: R28.2
1out: D7.2(K) D8.2(K) R12#2.1 R77.2
2: R31.2
2out: D10.2(K) R11#2.1 R76.2
3: R34.2
3out: D9.2(K) R75.2
4: R37.2
4out: D11.2(K) D12.2(K) R74.2
5: R46.2
5out: D16.2(K) D17.2(K) D18.2(K) R73.2
6: R43.2
6out: D15.2(K) R72.2
7: R40.2
7out: D19.2(K) D20.2(K) R71.2
8: R55.2
8out: D14.2(K) R70.2
9: R52.2
9out: D13.2(K) R69.2
10: R49.2
11: R64.2
12: R61.2
13: R58.2
14: R67.2
+5A: C24#2.2 U1.1.8(VCC+)
+12: C3.1 C5.2 R1.2 R6.1 R15.2 R16.2 U1.7(VCC+)
+12A: C24.2 C28.1 C31.1 C34.1 C47.1 C49.1 C51.1 C56.1 R81.3 U3.4(V+) U4.4(V+) U5.4(V+) U6.4(V+) U7.7(VCC+) U8.7(VCC+) U9.8(VCC+) U10.7(VCC+) U11.7(VCC+) U12.7(VCC+) U13.7(VCC+)
+12D: C6.1 C7.2 R27.2 R32.2 R35.2 R38.2 R39.2 R42.2 R47.2 R48.2 R51.2 R56.2 R57.2 R60.2 R66.2 R68.2 U2.1(IN)
-5A: C25.2 C25#2.2 U1.1.4(VCC-) U3.11(V-) U4.11(V-) U5.11(V-) U6.11(V-)
-12: C2.1 C4.2 R3.1 R8.2 R17.1 R18.1 R19.1 R20.1 R21.1 U1.4(VCC-)
-12A: C29.1 C30.1 C35.1 C46.1 C48.1 C50.1 C57.1 U7.4(VCC-) U8.4(VCC-) U9.4(VCC-) U10.4(VCC-) U11.4(VCC-) U12.4(VCC-) U13.4(VCC-)
acin: R94.2 U10.3(IN+)
acout: C52.2
audio: R104.1 U13.6(OUT)
in1: C37.1
in2: C38.1
in3: C39.1
in4: C40.1
in5: C41.1
in6: C42.1
in7: C43.1
in8: C44.1
in9: C45.1
OUT: R26.2
out: C58.1
sig: R92.2 U9.5(IN2+)
tosig: R96.1 U11.6(OUT)
X: R25.2 R79.2
Y: C33.2 R24.2
Net-(C1#2-2): C1#2.2 C2#2.2 R1#2.1 U1.1.3(IN1+)
Net-(C1-1): C1.1 U1.5(COMP)
Net-(C1-2): C1.2 U1.8(COMP/BAL)
Net-(C2#2-1): C2#2.1 R2#2.1
Net-(C3#2-2): C3#2.2 C4#2.2 R6#2.1 U1.2.5(IN2+)
Net-(C4#2-1): C4#2.1 R7#2.1
Net-(C5#2-1): C5#2.1 R11#2.2
Net-(C5#2-2): C5#2.2 D3#2.1(A) D4#2.2(K) PR4#2.3 R8#2.2 R77#2.2 U1.2.7(OUT2)
Net-(C6#2-1): C6#2.1 R12#2.2
Net-(C6#2-2): C6#2.2 D1#2.2(K) D2#2.1(A) PR2#2.3 R3#2.2 R76#2.2 U1.1.1(OUT1)
Net-(C8-1): C8.1 L1.1 U2.3(OUT)
Net-(C9-1): C9.1 C26.2 L1.2 Q17.3(S) Q18.3(S) Q19.3(S) Q20.3(S) Q21.3(S) Q22.3(S) Q23.3(S) Q24.3(S) Q25.3(S) Q26.3(S) Q27.3(S) Q28.3(S) Q29.3(S) Q30.3(S)
Net-(C10-1): C10.1 Q17.2(D) R29.1 U3.5(INB+)
Net-(C11-1): C11.1 Q18.2(D) R30.1 U3.3(INA+)
Net-(C12-1): C12.1 Q19.2(D) R33.1 U3.12(IND+)
Net-(C13-1): C13.1 Q20.2(D) R36.1 U3.10(INC+)
Net-(C14-1): C14.1 Q21.2(D) R41.1 U4.12(IND+)
Net-(C15-1): C15.1 Q22.2(D) R44.1 U4.3(INA+)
Net-(C16-1): C16.1 Q23.2(D) R45.1 U4.5(INB+)
Net-(C17-1): C17.1 Q24.2(D) R50.1 U5.3(INA+)
Net-(C18-1): C18.1 Q25.2(D) R53.1 U5.5(INB+)
Net-(C19-1): C19.1 Q26.2(D) R54.1 U4.10(INC+)
Net-(C20-1): C20.1 Q27.2(D) R59.1 U6.5(INB+)
Net-(C21-1): C21.1 Q28.2(D) R62.1 U5.10(INC+)
Net-(C22-1): C22.1 Q29.2(D) R63.1 U5.12(IND+)
Net-(C23-1): C23.1 Q30.2(D) R65.1 U6.3(INA+)
Net-(C27-1): C27.1 U7.5(COMP)
Net-(C27-2): C27.2 U7.8(COMP/BAL)
Net-(C32-1): C32.1 U8.5(COMP)
Net-(C32-2): C32.2 U8.8(COMP/BAL)
Net-(C33-1): C33.1 R78.2 U8.2(IN-) U8.6(OUT)
Net-(C36-1): C36.1 R81.2 U9.3(IN1+)
Net-(C37-2): C37.2 R82.2
Net-(C38-2): C38.2 R83.2
Net-(C39-2): C39.2 R84.2
Net-(C40-2): C40.2 R85.2
Net-(C41-2): C41.2 R86.2
Net-(C42-2): C42.2 R87.2
Net-(C43-2): C43.2 R88.2
Net-(C44-2): C44.2 R89.2
Net-(C45-2): C45.2 R90.2
Net-(C52-1): C52.1 D23.2(K) D24.1(A) R98.1 R101.1 U12.6(OUT)
Net-(C53-2): C53.2 C54.1 R97.1 U12.3(IN+)
Net-(C54-2): C54.2 R98.2
Net-(C55-1): C55.1 U13.5(COMP)
Net-(C55-2): C55.2 U13.8(COMP/BAL)
Net-(C58-2): C58.2 R102.3
Net-(C59-1): C59.1 R103.2
Net-(D1#2-1): D1#2.1(A) D2#2.2(K) R3#2.1 R5#2.1
Net-(D1-1): D1.1(K) Q1.3(C) Q2.3(C) Q8.2(B) Q12.2(B)
Net-(D1-2): D1.2(A) D4.2(A) R1.1
Net-(D2-1): D2.1(C) PR1.3 PR3.3 R6.2
Net-(D3#2-2): D3#2.2(K) D4#2.1(A) R8#2.1 R9#2.1
Net-(D3-2): D3.2(A) PR1.1 PR3.1 R8.1
Net-(D4-1): D4.1(K) Q3.2(B) Q9.3(C) Q10.3(C) Q11.2(B)
Net-(D5-1): D5.1(K) R20.2
Net-(D5-2): D5.2(A) Q13.2(B) Q14.2(B) R4.2
Net-(D6-1): D6.1(K) R21.2
Net-(D6-2): D6.2(A) Q4.2(B) Q7.2(B) R5.2
Net-(D7-1): D7.1(A) U3.1(OUTA) U3.2(INA-)
Net-(D8-1): D8.1(A) U3.6(INB-) U3.7(OUTB)
Net-(D9-1): D9.1(A) U3.8(OUTC) U3.9(INC-)
Net-(D10-1): D10.1(A) U3.13(IND-) U3.14(OUTD)
Net-(D11-1): D11.1(A) U4.1(OUTA) U4.2(INA-)
Net-(D12-1): D12.1(A) U4.6(INB-) U4.7(OUTB)
Net-(D13-1): D13.1(A) U6.1(OUTA) U6.2(INA-)
Net-(D14-1): D14.1(A) U6.6(INB-) U6.7(OUTB)
Net-(D15-1): D15.1(A) U5.1(OUTA) U5.2(INA-)
Net-(D16-1): D16.1(A) U5.6(INB-) U5.7(OUTB)
Net-(D17-1): D17.1(A) U4.13(IND-) U4.14(OUTD)
Net-(D18-1): D18.1(A) U4.8(OUTC) U4.9(INC-)
Net-(D19-1): D19.1(A) U5.13(IND-) U5.14(OUTD)
Net-(D20-1): D20.1(A) U5.8(OUTC) U5.9(INC-)
Net-(D21-1): D21.1(K) R93.2 U11.3(IN+)
Net-(D21-2): D21.2(A) D22.1(K) U10.6(OUT)
Net-(D22-2): D22.2(A) R95.2 U10.2(IN-)
Net-(D23-1): D23.1(A) D24.2(K) R100.1 R101.2
Net-(PR1#2-1): PR1#2.1 PR1#2.2 R1#2.2
Net-(PR1-2): PR1.2 Q9.2(B)
Net-(PR2#2-1): PR2#2.1 PR2#2.2 R2#2.2
Net-(PR2-1): PR2.1 PR2.2 R4.1
Net-(PR3#2-1): PR3#2.1 PR3#2.2 R6#2.2
Net-(PR3-2): PR3.2 Q16.2(B)
Net-(PR4#2-1): PR4#2.1 PR4#2.2 R7#2.2
Net-(PR4-1): PR4.1 Q11.3(C) Q12.3(C) R16.1 U1.3(IN+)
Net-(PR4-2): PR4.2 PR4.3 R7.2
Net-(PR5-1): PR5.1 PR5.2 R29.2
Net-(PR6-1): PR6.1 PR6.2 R30.2
Net-(PR7-1): PR7.1 PR7.2 R33.2
Net-(PR8-1): PR8.1 PR8.2 R36.2
Net-(PR9-1): PR9.1 PR9.2 R41.2
Net-(PR10-1): PR10.1 PR10.2 R44.2
Net-(PR11-1): PR11.1 PR11.2 R45.2
Net-(PR12-1): PR12.1 PR12.2 R50.2
Net-(PR13-1): PR13.1 PR13.2 R53.2
Net-(PR14-1): PR14.1 PR14.2 R54.2
Net-(PR15-1): PR15.1 PR15.2 R59.2
Net-(PR16-1): PR16.1 PR16.2 R62.2
Net-(PR17-1): PR17.1 PR17.2 R63.2
Net-(PR18-1): PR18.1 PR18.2 R65.2
Net-(Q1-1): Q1.1(E) Q14.3(C) R2.1 R10.2
Net-(Q1-2): Q1.2(B) Q2.1(E) R2.2
Net-(Q2-2): Q2.2(B) R22.2 R24.1
Net-(Q3-1): Q3.1(E) Q5.3(C) Q6.3(C) Q12.1(E)
Net-(Q3-3): Q3.3(C) Q8.3(C) R9.1 R15.1 U1.2(IN-)
Net-(Q4-1): Q4.1(E) R18.2
Net-(Q4-3): Q4.3(C) Q6.1(E) R12.2 R13.1
Net-(Q5-1): Q5.1(E) Q6.2(B) R13.2
Net-(Q5-2): Q5.2(B) R23.2 R25.1
Net-(Q7-1): Q7.1(E) R19.2
Net-(Q7-3): Q7.3(C) Q15.1(E) R12.1 R14.1
Net-(Q8-1): Q8.1(E) Q11.1(E) Q15.3(C) Q16.3(C)
Net-(Q9-1): Q9.1(E) Q10.2(B) R11.2
Net-(Q10-1): Q10.1(E) Q13.3(C) R10.1 R11.1
Net-(Q13-1): Q13.1(E) R17.2
Net-(Q14-1): Q14.1(E) R3.2
Net-(Q15-2): Q15.2(B) Q16.1(E) R14.2
Net-(Q17-1): Q17.1(G) R27.1 R28.1
Net-(Q18-1): Q18.1(G) R31.1 R32.1
Net-(Q19-1): Q19.1(G) R34.1 R35.1
Net-(Q20-1): Q20.1(G) R37.1 R38.1
Net-(Q21-1): Q21.1(G) R39.1 R40.1
Net-(Q22-1): Q22.1(G) R42.1 R43.1
Net-(Q23-1): Q23.1(G) R46.1 R48.1
Net-(Q24-1): Q24.1(G) R47.1 R49.1
Net-(Q25-1): Q25.1(G) R51.1 R52.1
Net-(Q26-1): Q26.1(G) R55.1 R57.1
Net-(Q27-1): Q27.1(G) R56.1 R58.1
Net-(Q28-1): Q28.1(G) R60.1 R61.1
Net-(Q29-1): Q29.1(G) R64.1 R66.1
Net-(Q30-1): Q30.1(G) R67.1 R68.1
Net-(R4#2-2): R4#2.2 R5#2.2 U1.1.2(IN1-)
Net-(R9#2-2): R9#2.2 R10#2.2 U1.2.6(IN2-)
Net-(R9-2): R9.2 R26.1 U1.6(OUT)
Net-(R79-3): R79.3 U7.2(IN-) U7.6(OUT)
Net-(R80-1): R80.1 U9.6(IN2-) U9.7(OUT2)
Net-(R80-2): R80.2 U7.3(IN+)
Net-(R80-3): R80.3 U9.1(OUT1) U9.2(IN1-)
Net-(R82-1): R82.1 R83.1 R84.1 R85.1 R86.1 R87.1 R88.1 R89.1 R90.1 R91.3 U8.3(IN+)
Net-(R95-1): R95.1 R96.2 U11.2(IN-)
Net-(R99-1): R99.1 R100.2 U12.2(IN-)
Net-(R102-2): R102.2 U13.3(IN+)
Net-(R103-1): R103.1 R104.2 U13.2(IN-)
Net-(U6-8): U6.8(OUTC) U6.9(INC-)
Net-(U6-13): U6.13(IND-) U6.14(OUTD)

Not connected (* = marked no-connect by the designer): U1 1(BALANCE)*; U7 1(BALANCE)*; U8 1(BALANCE)*; U10 1(OFFSET_N1)* 5(NC)* 8(OFFSET_N2)*; U11 1(OFFSET_N1)* 5(NC)* 8(OFFSET_N2)*; U12 1(OFFSET_N1)* 5(OFFSET_N2)* 8(NC)*; U13 1(BALANCE)*

## Notes on the sheets
sheet 2
- R47
- R56
- R65
- BH2VGM
sheet 3
- GND
- BH2VGM
sheet 4
- BH2VGM
